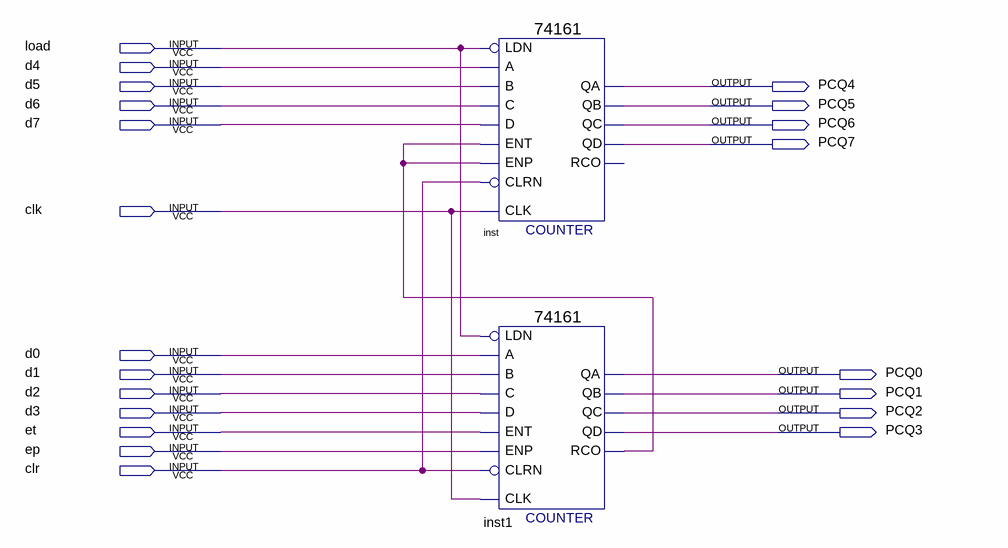
[diagram p0: schematic sheet]
// Quartus schematic uPC.bdf as structural Verilog: 2 symbols, 21 pins
module uPC (
  input  load,
  input  d4,
  input  d5,
  input  d6,
  input  d7,
  input  clk,
  input  d0,
  input  d1,
  input  d2,
  input  d3,
  input  et,
  input  ep,
  input  clr,
  output PCQ4,
  output PCQ5,
  output PCQ6,
  output PCQ7,
  output PCQ0,
  output PCQ1,
  output PCQ2,
  output PCQ3
);

  wire inst1_rco;

  \74161  inst (
    .CLRN(clr), .CLK(clk), .ENP(inst1_rco), .LDN(load), .A(d4), .D(d7), .ENT(inst1_rco), .B(d5), .C(d6),
    .QD(PCQ7), .QC(PCQ6), .QB(PCQ5), .QA(PCQ4));  // open: RCO
  \74161  inst1 (
    .CLRN(clr), .CLK(clk), .ENP(ep), .LDN(load), .A(d0), .D(d3), .ENT(et), .B(d1), .C(d2), .QD(PCQ3),
    .QC(PCQ2), .QB(PCQ1), .QA(PCQ0), .RCO(inst1_rco));
endmodule
